# Altium schematic sheet Top.SchDoc
size A
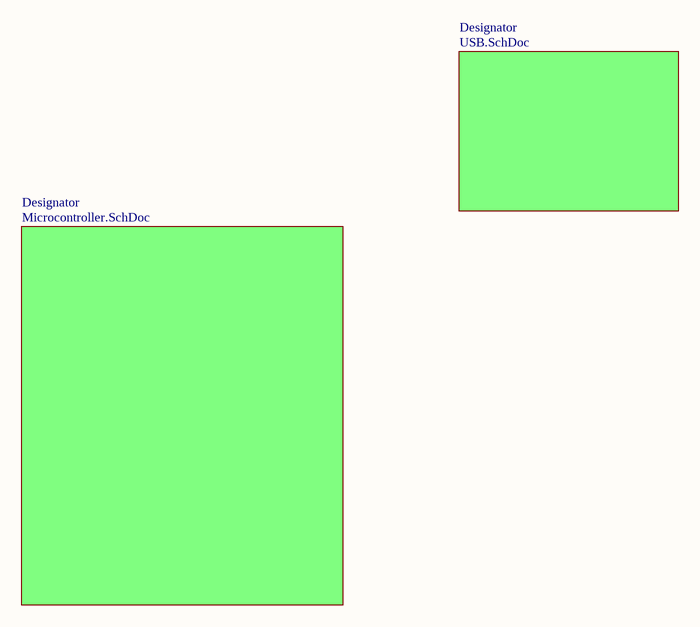
[diagram p0: Top.SchDoc]

## Sub-sheets
Designator = Microcontroller.SchDoc: no entries
Designator = USB.SchDoc: no entries